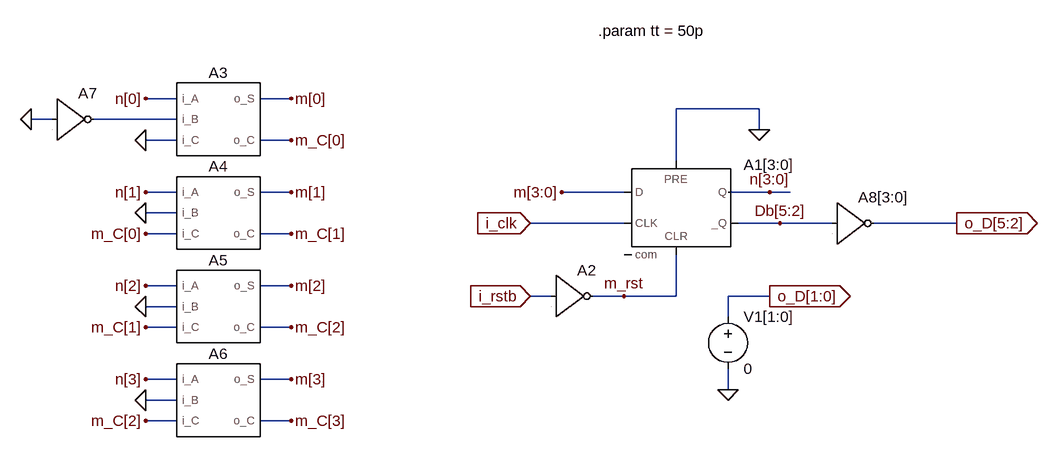
[diagram p0: schematic RAMP.asc]
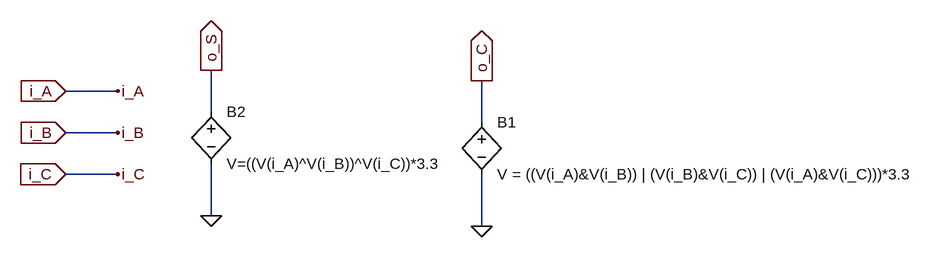
[diagram p1: sub-circuit fa.asc]
RAMP.asc, the LTspice schematic file:
Version 4
SHEET 1 1464 752
WIRE -96 208 -144 208
WIRE 80 208 32 208
WIRE 800 224 672 224
WIRE -288 240 -320 240
WIRE -96 240 -224 240
WIRE 800 256 800 224
WIRE -96 272 -144 272
WIRE 80 272 32 272
WIRE 672 304 672 224
WIRE -96 352 -144 352
WIRE 80 352 32 352
WIRE 592 352 496 352
WIRE 816 352 752 352
WIRE 848 352 816 352
WIRE -96 384 -144 384
WIRE 592 400 448 400
WIRE 832 400 768 400
WIRE 912 400 832 400
WIRE 1104 400 976 400
WIRE -96 416 -144 416
WIRE 80 416 32 416
WIRE -96 496 -144 496
WIRE 80 496 32 496
WIRE 480 512 448 512
WIRE 592 512 544 512
WIRE 672 512 672 448
WIRE 672 512 592 512
WIRE 816 512 752 512
WIRE -96 528 -144 528
WIRE 752 544 752 512
WIRE -96 560 -144 560
WIRE 80 560 32 560
WIRE -96 640 -144 640
WIRE 80 640 32 640
WIRE 752 656 752 624
WIRE -96 672 -144 672
WIRE -96 704 -144 704
WIRE 80 704 32 704
FLAG 1104 400 o_D[5:2]
IOPIN 1104 400 Out
FLAG 816 512 o_D[1:0]
IOPIN 816 512 Out
FLAG 752 656 0
FLAG 800 256 0
FLAG 448 512 i_rstb
IOPIN 448 512 In
FLAG 448 400 i_clk
IOPIN 448 400 In
FLAG 496 352 m[3:0]
FLAG 592 512 m_rst
FLAG -144 272 0
FLAG -144 208 n[0]
FLAG -320 240 0
FLAG 80 208 m[0]
FLAG 80 272 m_C[0]
FLAG -144 352 n[1]
FLAG -144 496 n[2]
FLAG -144 640 n[3]
FLAG -144 384 0
FLAG -144 528 0
FLAG -144 672 0
FLAG 80 352 m[1]
FLAG 80 416 m_C[1]
FLAG 80 496 m[2]
FLAG 80 560 m_C[2]
FLAG 80 640 m[3]
FLAG 80 704 m_C[3]
FLAG -144 416 m_C[0]
FLAG -144 560 m_C[1]
FLAG -144 704 m_C[2]
FLAG 832 400 Db[5:2]
FLAG 816 352 n[3:0]
SYMBOL Digital/dflop 672 304 R0
WINDOW 3 8 6 Invisible 2
SYMATTR InstName A1[3:0]
SYMATTR Value Vhigh = 3.3 Vlow = 0 Trise = 'tt' Tfall = 'tt'
SYMBOL voltage 752 528 R0
SYMATTR InstName V1[1:0]
SYMATTR Value 0
SYMBOL Digital/inv 480 448 R0
WINDOW 3 8 104 Invisible 2
SYMATTR InstName A2
SYMATTR Value Vhigh = 3.3 Vlow = 0
SYMBOL FA -32 240 R0
SYMATTR InstName A3
SYMBOL FA -32 384 R0
SYMATTR InstName A4
SYMBOL FA -32 528 R0
SYMATTR InstName A5
SYMBOL FA -32 672 R0
SYMATTR InstName A6
SYMBOL Digital/inv -288 176 R0
WINDOW 3 8 104 Invisible 2
SYMATTR InstName A7
SYMATTR Value Vhigh = 3.3 Vlow = 0 Trise = 'tt' Tfall = 'tt'
SYMBOL Digital/inv 912 336 R0
WINDOW 3 8 104 Invisible 2
SYMATTR InstName A8[3:0]
SYMATTR Value Vhigh = 3.3 Vlow = 0 Trise = 'tt' Tfall = 'tt'
TEXT 552 104 Left 2 !.param tt = 50p

fa.asc, the sub-circuit schematic file:
Version 4
SHEET 1 1380 680
WIRE 112 128 32 128
WIRE 256 160 256 96
WIRE 672 176 672 112
WIRE 112 192 32 192
WIRE 112 256 32 256
WIRE 256 320 256 240
WIRE 672 336 672 256
FLAG 672 336 0
FLAG 256 320 0
FLAG 672 112 o_C
IOPIN 672 112 Out
FLAG 256 96 o_S
IOPIN 256 96 Out
FLAG 32 128 i_A
IOPIN 32 128 In
FLAG 32 192 i_B
IOPIN 32 192 In
FLAG 32 256 i_C
IOPIN 32 256 In
FLAG 112 128 i_A
FLAG 112 192 i_B
FLAG 112 256 i_C
SYMBOL bv 672 160 R0
SYMATTR InstName B1
SYMATTR Value V = ((V(i_A)&V(i_B)) | (V(i_B)&V(i_C)) | (V(i_A)&V(i_C)))*3.3
SYMBOL bv 256 144 R0
SYMATTR InstName B2
SYMATTR Value V=((V(i_A)^V(i_B))^V(i_C))*3.3

The netlist it stands for:
* RAMP.asc
A1[3:0] m[3:0] 0 i_clk 0 m_rst Db[5:2] n[3:0] 0 DFLOP Vhigh = 3.3 Vlow = 0 Trise = 'tt' Tfall = 'tt'
V1[1:0] o_D[1:0] 0 0
A2 i_rstb 0 0 0 0 m_rst 0 0 BUF Vhigh = 3.3 Vlow = 0
XA3 n[0] N001 0 m_C[0] m[0] fa
XA4 n[1] 0 m_C[0] m_C[1] m[1] fa
XA5 n[2] 0 m_C[1] m_C[2] m[2] fa
XA6 n[3] 0 m_C[2] m_C[3] m[3] fa
A7 0 0 0 0 0 N001 0 0 BUF Vhigh = 3.3 Vlow = 0 Trise = 'tt' Tfall = 'tt'
A8[3:0] Db[5:2] 0 0 0 0 o_D[5:2] 0 0 BUF Vhigh = 3.3 Vlow = 0 Trise = 'tt' Tfall = 'tt'

* block symbol definitions
.subckt fa i_A i_B i_C o_C o_S
B1 o_C 0 V = ((V(i_A)&V(i_B)) | (V(i_B)&V(i_C)) | (V(i_A)&V(i_C)))*3.3
B2 o_S 0 V=((V(i_A)^V(i_B))^V(i_C))*3.3
.ends fa

.param tt = 50p
.backanno
.end